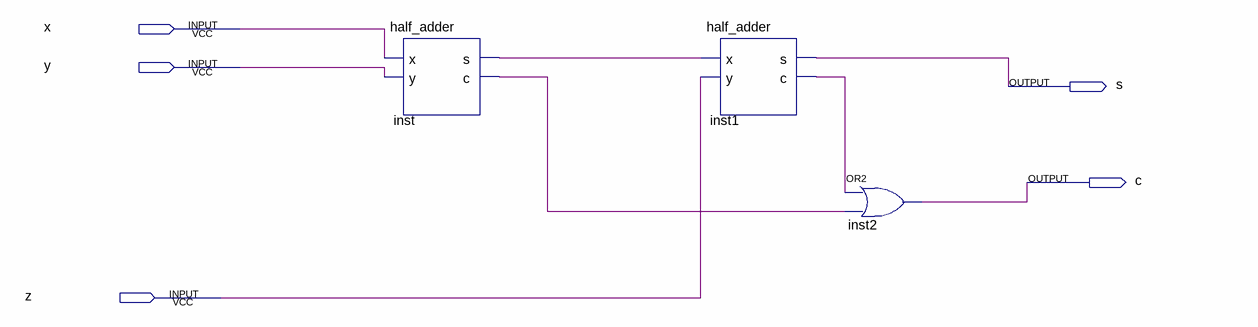
[diagram p0: schematic sheet]
// Quartus schematic fulladderProject.bdf as structural Verilog: 3 symbols, 5 pins
module fulladderProject (
  input  x,
  input  y,
  input  z,
  output s,
  output c
);

  wire inst1_c, inst_c, inst_s;

  half_adder inst (.x(x), .y(y), .s(inst_s), .c(inst_c));
  half_adder inst1 (.x(inst_s), .y(z), .s(s), .c(inst1_c));
  or inst2 (c, inst1_c, inst_c);
endmodule
